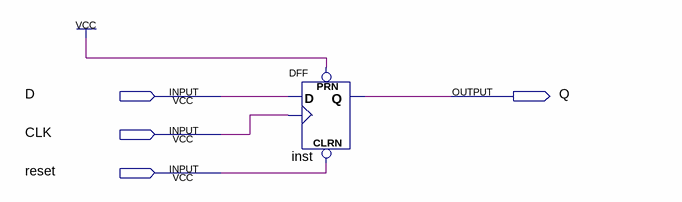
[diagram p0: schematic sheet]
// Quartus schematic FFD.bdf as structural Verilog: 1 symbols, 4 pins
module FFD (
  input  D,
  input  CLK,
  input  reset,
  output Q
);

  DFF inst (.CLRN(reset), .CLK(CLK), .D(D), .PRN(1'b1), .Q(Q));
endmodule
